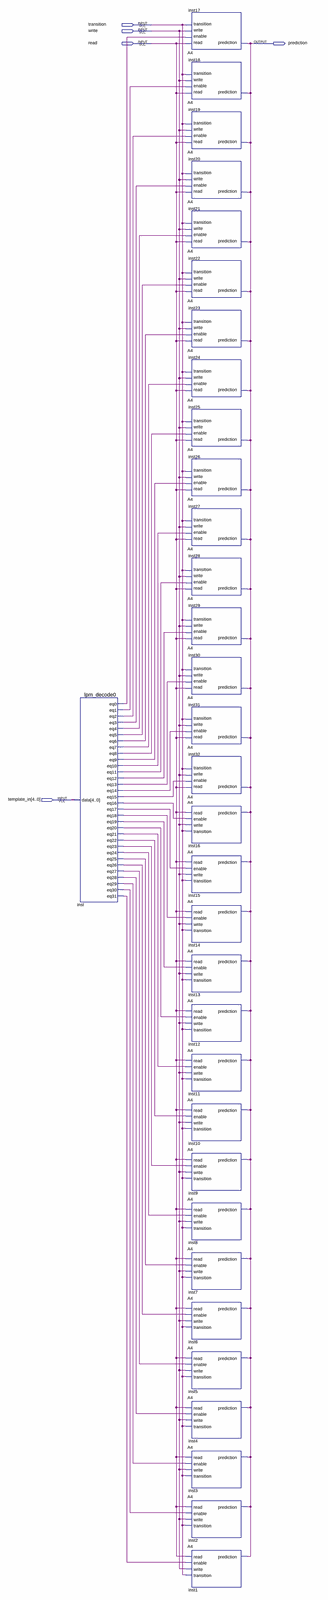
[diagram p0: schematic sheet, whole]
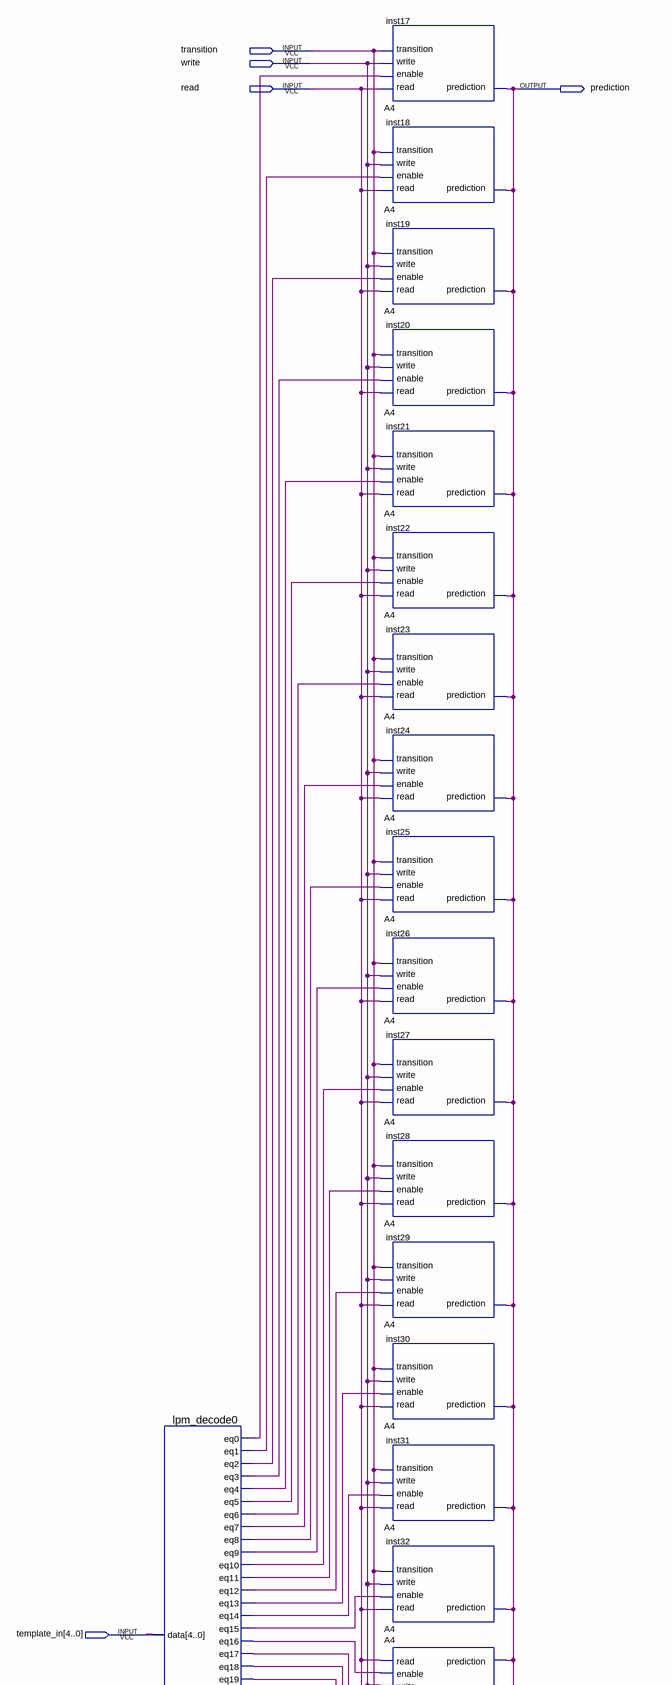
[diagram p1: schematic sheet, upper part]
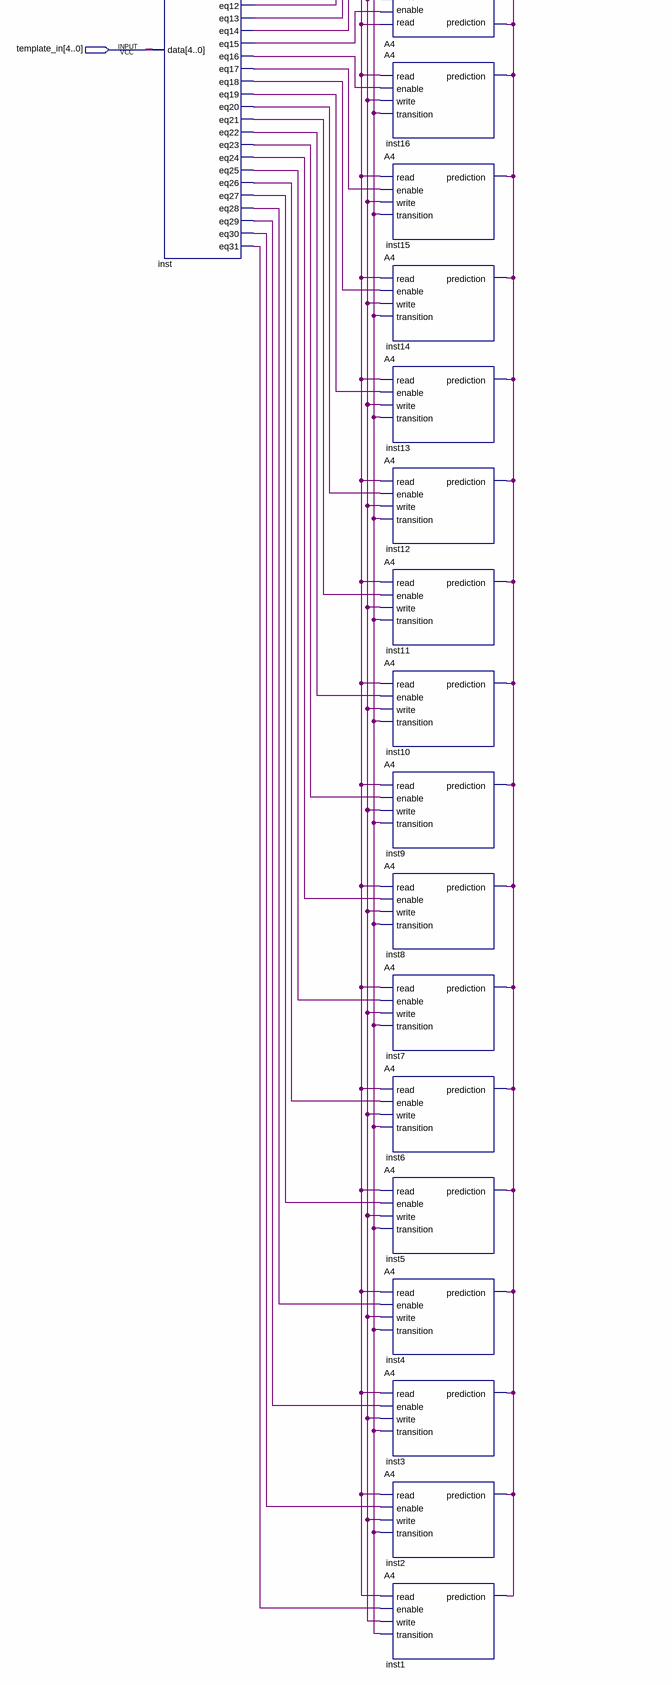
[diagram p2: schematic sheet, lower part]
// Quartus schematic PHT.bdf as structural Verilog: 33 symbols, 5 pins
module PHT (
  input  transition,
  input  write,
  input  read,
  input  [4:0] template_in,
  output prediction
);

  wire inst_eq0, inst_eq1, inst_eq2, inst_eq3, inst_eq4, inst_eq5, inst_eq6, inst_eq7, inst_eq8, inst_eq9,
       inst_eq10, inst_eq11, inst_eq12, inst_eq13, inst_eq14, inst_eq15, inst_eq16, inst_eq17, inst_eq18,
       inst_eq19, inst_eq20, inst_eq21, inst_eq22, inst_eq23, inst_eq24, inst_eq25, inst_eq26, inst_eq27,
       inst_eq28, inst_eq29, inst_eq30, inst_eq31;

  lpm_decode0 inst (
    .data(template_in), .eq0(inst_eq0), .eq1(inst_eq1), .eq2(inst_eq2), .eq3(inst_eq3), .eq4(inst_eq4),
    .eq5(inst_eq5), .eq6(inst_eq6), .eq7(inst_eq7), .eq8(inst_eq8), .eq9(inst_eq9), .eq10(inst_eq10),
    .eq11(inst_eq11), .eq12(inst_eq12), .eq13(inst_eq13), .eq14(inst_eq14), .eq15(inst_eq15),
    .eq16(inst_eq16), .eq17(inst_eq17), .eq18(inst_eq18), .eq19(inst_eq19), .eq20(inst_eq20),
    .eq21(inst_eq21), .eq22(inst_eq22), .eq23(inst_eq23), .eq24(inst_eq24), .eq25(inst_eq25),
    .eq26(inst_eq26), .eq27(inst_eq27), .eq28(inst_eq28), .eq29(inst_eq29), .eq30(inst_eq30), .eq31(inst_eq31));
  A4 inst17 (.read(read), .enable(inst_eq0), .write(write), .transition(transition), .prediction(prediction));
  A4 inst18 (.read(read), .enable(inst_eq1), .write(write), .transition(transition), .prediction(prediction));
  A4 inst19 (.read(read), .enable(inst_eq2), .write(write), .transition(transition), .prediction(prediction));
  A4 inst20 (.read(read), .enable(inst_eq3), .write(write), .transition(transition), .prediction(prediction));
  A4 inst21 (.read(read), .enable(inst_eq4), .write(write), .transition(transition), .prediction(prediction));
  A4 inst22 (.read(read), .enable(inst_eq5), .write(write), .transition(transition), .prediction(prediction));
  A4 inst23 (.read(read), .enable(inst_eq6), .write(write), .transition(transition), .prediction(prediction));
  A4 inst24 (.read(read), .enable(inst_eq7), .write(write), .transition(transition), .prediction(prediction));
  A4 inst25 (.read(read), .enable(inst_eq8), .write(write), .transition(transition), .prediction(prediction));
  A4 inst26 (.read(read), .enable(inst_eq9), .write(write), .transition(transition), .prediction(prediction));
  A4 inst27 (.read(read), .enable(inst_eq10), .write(write), .transition(transition), .prediction(prediction));
  A4 inst28 (.read(read), .enable(inst_eq11), .write(write), .transition(transition), .prediction(prediction));
  A4 inst29 (.read(read), .enable(inst_eq12), .write(write), .transition(transition), .prediction(prediction));
  A4 inst30 (.read(read), .enable(inst_eq13), .write(write), .transition(transition), .prediction(prediction));
  A4 inst31 (.read(read), .enable(inst_eq14), .write(write), .transition(transition), .prediction(prediction));
  A4 inst32 (.read(read), .enable(inst_eq15), .write(write), .transition(transition), .prediction(prediction));
  A4 inst16 (.read(read), .enable(inst_eq16), .write(write), .transition(transition), .prediction(prediction));
  A4 inst15 (.read(read), .enable(inst_eq17), .write(write), .transition(transition), .prediction(prediction));
  A4 inst14 (.read(read), .enable(inst_eq18), .write(write), .transition(transition), .prediction(prediction));
  A4 inst13 (.read(read), .enable(inst_eq19), .write(write), .transition(transition), .prediction(prediction));
  A4 inst12 (.read(read), .enable(inst_eq20), .write(write), .transition(transition), .prediction(prediction));
  A4 inst11 (.read(read), .enable(inst_eq21), .write(write), .transition(transition), .prediction(prediction));
  A4 inst10 (.read(read), .enable(inst_eq22), .write(write), .transition(transition), .prediction(prediction));
  A4 inst9 (.read(read), .enable(inst_eq23), .write(write), .transition(transition), .prediction(prediction));
  A4 inst8 (.read(read), .enable(inst_eq24), .write(write), .transition(transition), .prediction(prediction));
  A4 inst7 (.read(read), .enable(inst_eq25), .write(write), .transition(transition), .prediction(prediction));
  A4 inst6 (.read(read), .enable(inst_eq26), .write(write), .transition(transition), .prediction(prediction));
  A4 inst5 (.read(read), .enable(inst_eq27), .write(write), .transition(transition), .prediction(prediction));
  A4 inst4 (.read(read), .enable(inst_eq28), .write(write), .transition(transition), .prediction(prediction));
  A4 inst3 (.read(read), .enable(inst_eq29), .write(write), .transition(transition), .prediction(prediction));
  A4 inst2 (.read(read), .enable(inst_eq30), .write(write), .transition(transition), .prediction(prediction));
  A4 inst1 (.read(read), .enable(inst_eq31), .write(write), .transition(transition), .prediction(prediction));
endmodule
